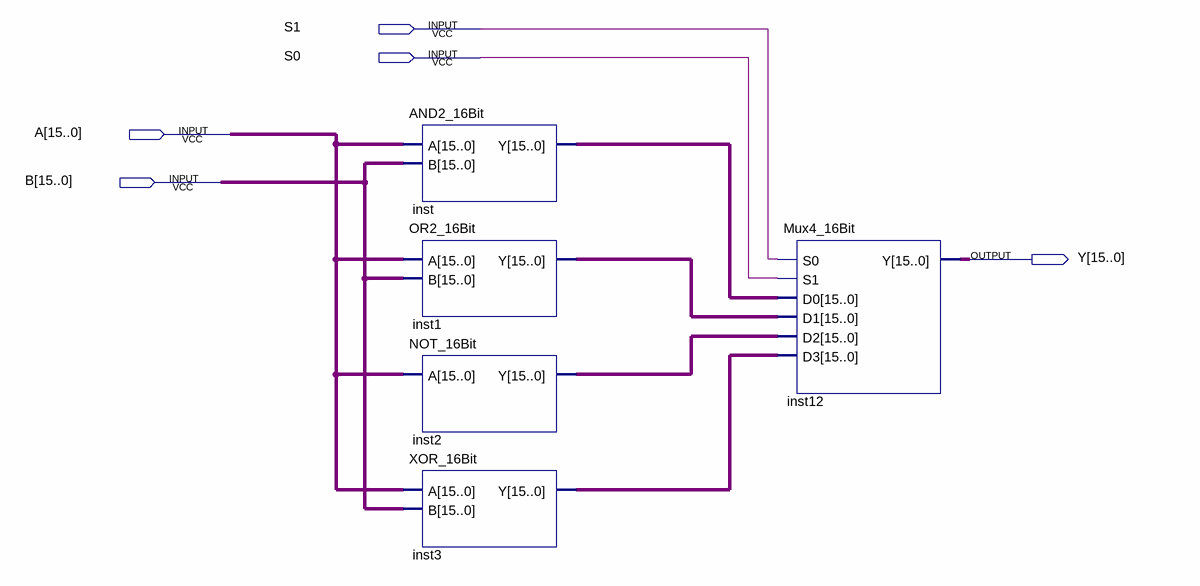
[diagram p0: schematic sheet]
// Quartus schematic LU_16Bit.bdf as structural Verilog: 5 symbols, 5 pins
module LU_16Bit (
  input  S1,
  input  S0,
  input  [15:0] A,
  input  [15:0] B,
  output [15:0] Y
);

  wire [15:0] inst1_y, inst2_y, inst3_y, inst_y;

  AND2_16Bit inst (.A(A), .B(B), .Y(inst_y));
  OR2_16Bit inst1 (.A(A), .B(B), .Y(inst1_y));
  NOT_16Bit inst2 (.A(A), .Y(inst2_y));
  XOR_16Bit inst3 (.A(A), .B(B), .Y(inst3_y));
  Mux4_16Bit inst12 (.S0(S1), .S1(S0), .D0(inst_y), .D1(inst1_y), .D2(inst2_y), .D3(inst3_y), .Y(Y));
endmodule
